# EAGLE design emitter (EAGLE 7.3.0)
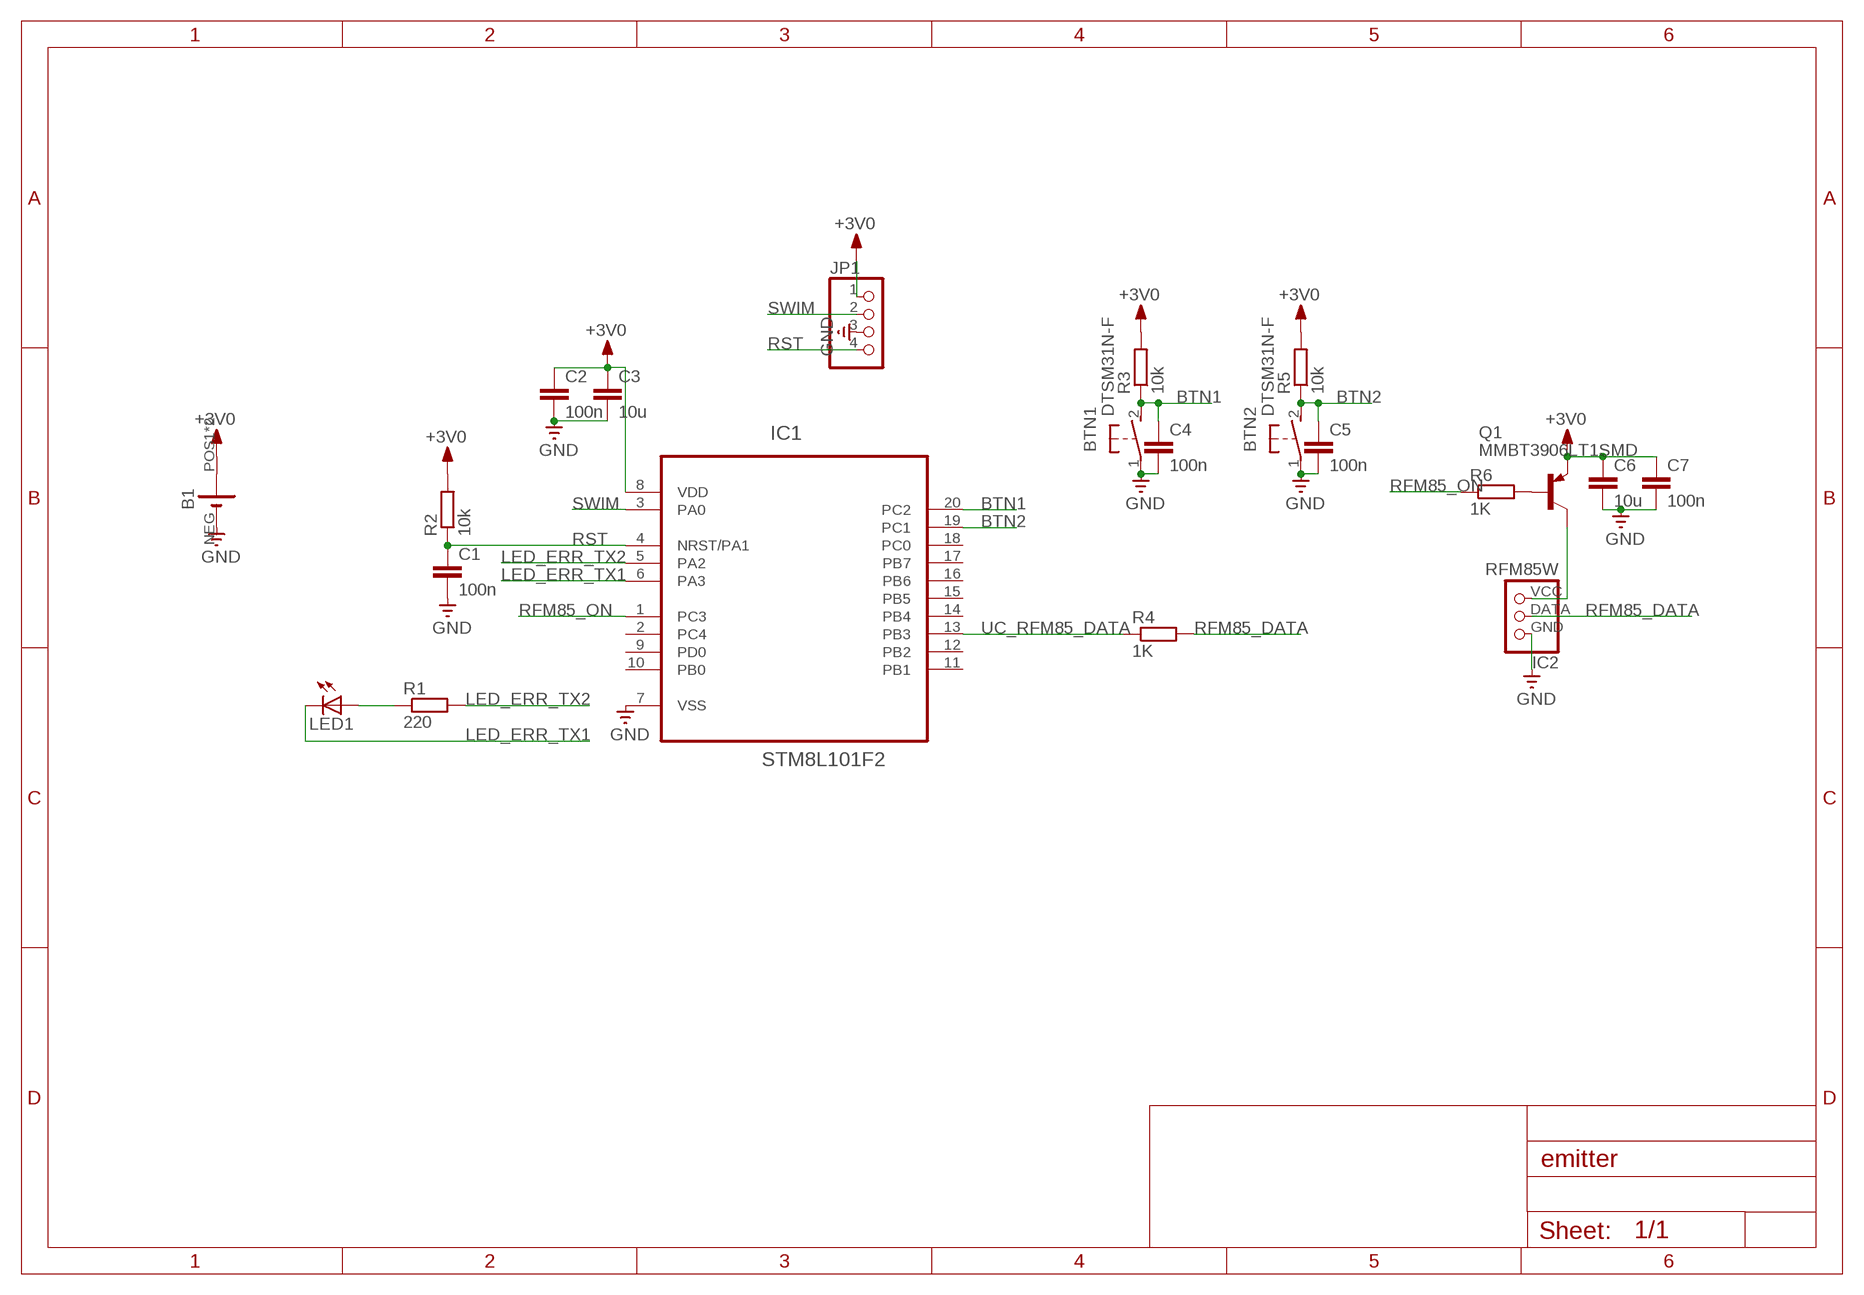
[diagram p0: schematic, sheet 1]

## Parts
B1  CR2032_HOLDER_BC-2003  [CR2032_HOLDER_BC-2003]
BTN1  DTSM31N-F  [DTSM31N-F]
BTN2  DTSM31N-F  [DTSM31N-F]
C1  100n  C-EUC0603K  [C0603K]
C2  100n  C-EUC0603K  [C0603K]
C3  10u  C-EUC0805K  [C0805K]
C4  100n  C-EUC0603K  [C0603K]
C5  100n  C-EUC0603K  [C0603K]
C6  10u  C-EUC0805K  [C0805K]
C7  100n  C-EUC0603K  [C0603K]
IC1  STM8L101F2  [TSSOP20]
IC2  RFM85W  [RFM85W_CON]
JP1  PINHD-1X4  [1X04]
LED1  LED3MM  [LED3MM]
Q1  MMBT3906LT1SMD  [SOT23-BEC]
R1  220  R-EU_R0603  [R0603]
R2  10k  R-EU_R0603  [R0603]
R3  10k  R-EU_R0603  [R0603]
R4  1K  R-EU_R0603  [R0603]
R5  10k  R-EU_R0603  [R0603]
R6  1K  R-EU_R0603  [R0603]

## Nets
+3V0: B1.POS1(+) B1.POS2(+) C2.1 C3.1 C6.1 C7.1 IC1.8(VDD) JP1.1 Q1.E R2.2 R3.2 R5.2
BTN1: BTN1.2 C4.1 IC1.20(PC2) R3.1
BTN2: BTN2.2 C5.1 IC1.19(PC1) R5.1
GND: B1.NEG(-) BTN1.1 BTN2.1 C1.2 C2.2 C3.2 C4.2 C5.2 C6.2 C7.2 IC1.7(VSS) IC2.GND JP1.3
LED_ERR_TX1: IC1.6(PA3) LED1.K(C)
LED_ERR_TX2: IC1.5(PA2) R1.2
N$1: LED1.A R1.1
N$2: IC2.VCC Q1.C
N$8: Q1.B R6.2
RFM85_DATA: IC2.DATA R4.2
RFM85_ON: IC1.1(PC3) R6.1
RST: C1.1 IC1.4(NRST/PA1) JP1.4 R2.1
SWIM: IC1.3(PA0) JP1.2
UC_RFM85_DATA: IC1.13(PB3) R4.1
Unconnected: IC1.2(PC4) IC1.9(PD0) IC1.10(PB0) IC1.11(PB1) IC1.12(PB2) IC1.14(PB4) IC1.15(PB5) IC1.16(PB6) IC1.17(PB7) IC1.18(PC0)

## Library data of the parts
B1 = comp_RFSwitch_v2:CR2032_HOLDER_BC-2003
BTN1 BTN2 = comp_RFSwitch_v3:DTSM31N-F
C1-C7 = resistor:C-EU: CAPACITOR, European symbol
IC1 = comp_RFSwitch_v2:STM8L101F2
IC2 = comp_RFSwitch_v3:RFM85W
JP1 = pinhead:PINHD-1X4: PIN HEADER
LED1 = led:LED: LED OSRAM: - CHIPLED LG R971, LG N971, LY N971, LG Q971, LY Q971, LO R971, LY R971 LH N974, LH R974 LS Q976, LO Q976, LY Q976 LO Q996 - Hyper CHIPLED LW Q18S LB Q993, LB Q99A, LB R99A - SideLED LS A670, LO A670, LY A670, LG A670, LP A670 LB A673, LV A673, LT A673, LW A673 LH A674 LY A675 LS A676, LA A676, LO A676, LY A676, LW A676 LS A679, LY A679, LG A679 - Hyper Micro SIDELED® LS Y876, LA Y876, LO Y876, LY Y876 LT Y87S - SmartLED LW L88C, LW L88S LB L89C, LB L89S, LG L890 LS L89K, LO L89K, LY L89K LS L896, LA L896, LO L896, LY L896 - TOPLED LS T670, LO T670, LY T670, LG T670, LP T670 LSG T670, LSP T670, LSY T670, LOP T670, LYG T670 LG T671, LOG T671, LSG T671 LB T673, LV T673, LT T673, LW T673 LH T674 LS T676, LA T676, LO T676, LY T676, LB T676, LH T676, LSB T676, LW T676 LB T67C, LV T67C, LT T67C, LS T67K, LO T67K, LY T67K, LW E67C LS E67B, LA E67B, LO E67B, LY E67B, LB E67C, LV E67C, LT E67C LW T67C LS T679, LY T679, LG T679 LS T770, LO T770, LY T770, LG T770, LP T770 LB T773, LV T773, LT T773, LW T773 LH T774 LS E675, LA E675, LY E675, LS T675 LS T776, LA T776, LO T776, LY T776, LB T776 LHGB T686 LT T68C, LB T68C - Hyper Mini TOPLED® LB M676 - Mini TOPLED Santana® LG M470 LS M47K, LO M47K, LY M47K Source: http://www.osram.convergy.de LUXEON: - LUMILED® LXK2-PW12-R00, LXK2-PW12-S00, LXK2-PW14-U00, LXK2-PW14-V00 LXK2-PM12-R00, LXK2-PM12-S00, LXK2-PM14-U00 LXK2-PE12-Q00, LXK2-PE12-R00, LXK2-PE12-S00, LXK2-PE14-T00, LXK2-PE14-U00 LXK2-PB12-K00, LXK2-PB12-L00, LXK2-PB12-M00, LXK2-PB14-N00, LXK2-PB14-P00, LXK2-PB14-Q00 LXK2-PR12-L00, LXK2-PR12-M00, LXK2-PR14-Q00, LXK2-PR14-R00 LXK2-PD12-Q00, LXK2-PD12-R00, LXK2-PD12-S00 LXK2-PH12-R00, LXK2-PH12-S00 LXK2-PL12-P00, LXK2-PL12-Q00, LXK2-PL12-R00 Source: www.luxeon.com KINGBRIGHT: KA-3528ASYC Source: www.kingbright.com
Q1 = transistor-pnp:MMBT3906*: PNP Transistror
R1-R6 = resistor:R-EU_: RESISTOR, European symbol

## Board
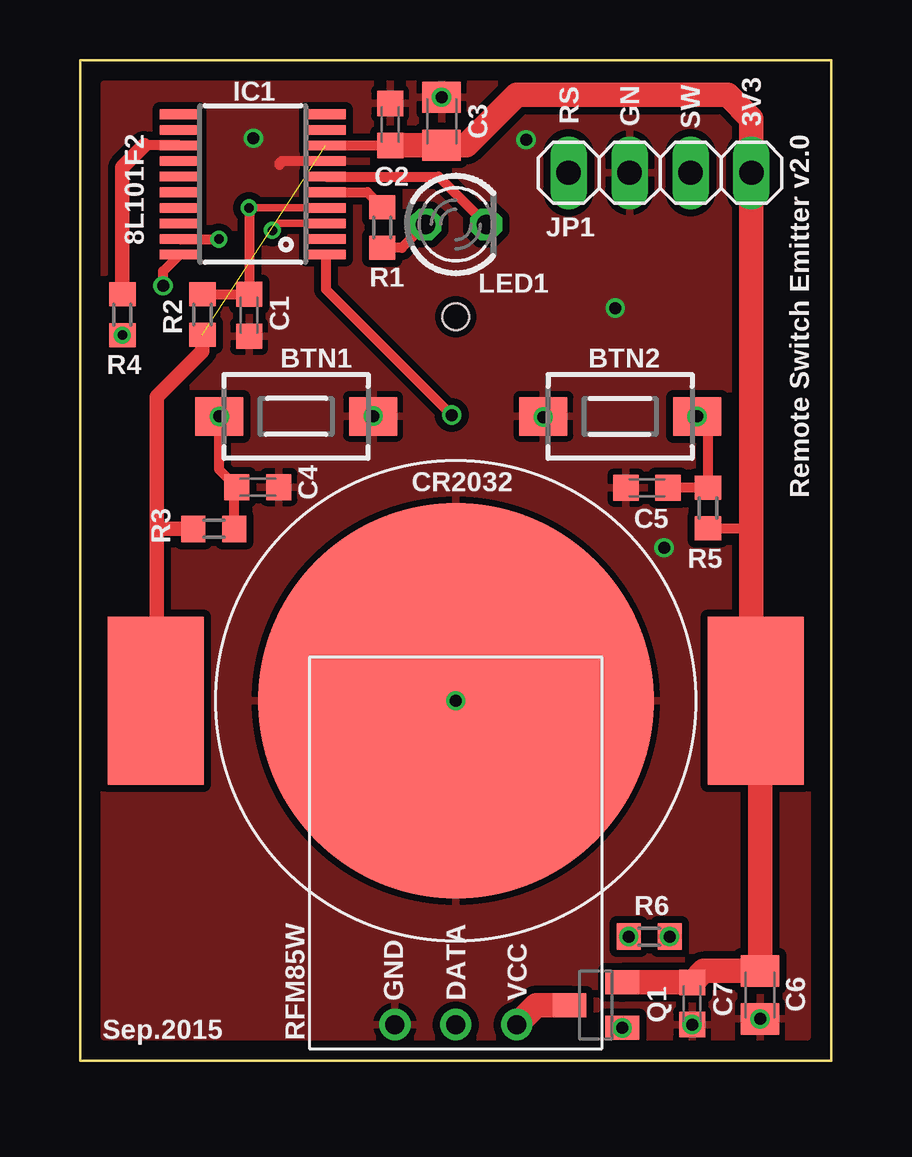
[diagram p1: board, top side]
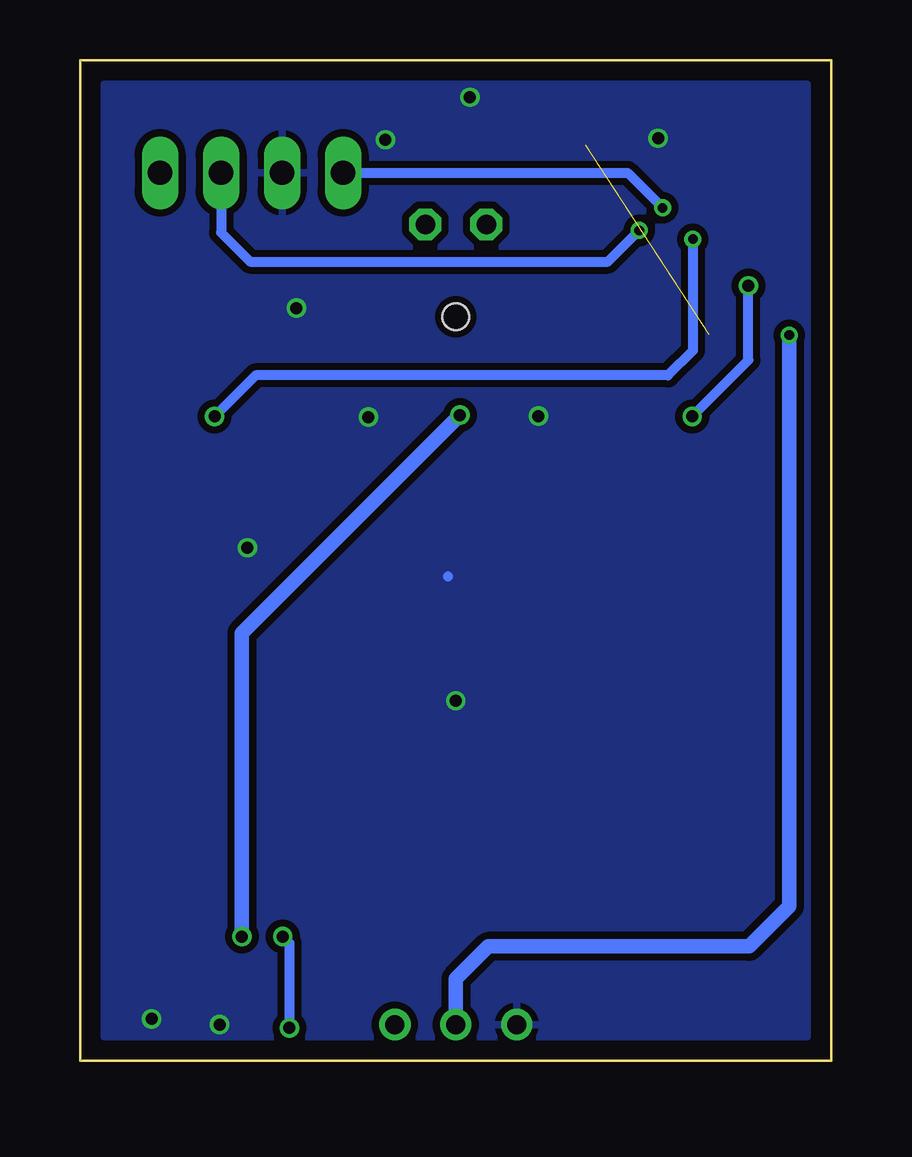
[diagram p2: board, bottom side, seen from below]

Size 31.3 x 41.7 mm. Coordinates in mm from the lower left corner, seen from the top.
Outline: 31.3,41.7 0,41.7 0,0 31.3,0 31.3,41.7
Copper layers (1*16): Top 0.035mm / dielectric 1.5mm / Bottom 0.035mm
Design rules "SeeedStudio_2layer_DRU_no_angle_20140221": minimum track width 6mil, minimum drill 12mil, track to track 6mil, track to pad 6mil, pad to pad 6mil, via to via 6mil, smd to smd 0mil, copper to edge 10mil, drill to drill 10mil, minimum pad ring 10mil, minimum via ring 6mil, stop-mask expansion 2mil, vias tented up to drill 100mil, thermal gap 10mil
Holes 1.1 mm at 15.65,31

### Footprints (pad centres in the part's own frame; a part is rotated, then mirrored left to right if it is on the bottom)
CR2032_HOLDER_BC-2003 = smd 16.5 x 16.5: NEG 0,0 | smd 4 x 7: POS1 -12.5,0; POS2 12.5,0
DTSM31N-F = smd 2 x 1.6: 1 -3.2,0; 2 3.2,0
C0603K = smd 1.05 x 1.08: 1 -0.875,0; 2 0.875,0
C0805K = smd 1.3 x 1.6: 1 -1,0; 2 1,0
TSSOP20 = smd 0.4 x 1.65: 1 -3.575,-3.05; 2 -2.925,-3.05; 3 -2.275,-3.05; 4 -1.625,-3.05; 5 -0.975,-3.05; 6 -0.325,-3.05; 7 0.325,-3.05; 8 0.975,-3.05; 9 1.625,-3.05; 10 2.275,-3.05; 11 2.275,3.05; 12 1.625,3.05; 13 0.975,3.05; 14 0.325,3.05; 15 -0.325,3.05; 16 -0.975,3.05; 17 -1.625,3.05; 18 -2.275,3.05; 19 -2.925,3.05; 20 -3.575,3.05
RFM85W_CON = drill 0.8: DATA 0,1; GND -2.54,1; VCC 2.54,1
1X04 = drill 1.016 long: 1 -3.81,0; 2 -1.27,0; 3 1.27,0; 4 3.81,0
LED3MM = drill 0.813 octagon: A -1.27,0; K 1.27,0
SOT23-BEC = smd 1 x 1.4: B -0.95,-1.1; C 0,1.1; E 0.95,-1.1
R0603 = smd 1 x 1.1: 1 -0.85,0; 2 0.85,0

### Placement (x,y rotation side)
B1  15.65,15 0 top
BTN1  9,26.85 180 top
BTN2  22.5,26.85 0 top
C1  7.04,31.07 270 top
C2  12.91,39.02 90 top
C3  15.06,39.15 90 top
C4  7.39,23.9 0 top
C5  23.61,23.88 180 top
C6  28.32,2.75 270 top
C7  25.5,2.38 270 top
IC1  7.19,37.16 90 top
IC2  15.65,0.51 0 top
JP1  24.16,37 180 top
LED1  15.65,34.85 0 top
Q1  21.48,2.32 90 top
R1  12.59,34.72 90 top
R2  5.09,31.1 270 top
R3  5.57,22.16 180 top
R4  1.75,31.09 270 top
R5  26.16,23.03 270 top
R6  23.71,5.17 180 top

### Tracks (layer width: path | path; a pad name or v marks a point on that pad's centre or on a via)
+3V0  (1 unrouted)
  Top 0.406: IC1.8 C2.1 | R5.2 27.9,22.18 27.97,22.11
  Top 0.61: 27.91,31.55 27.97,31.49 | B1.POS1 3.19,15.04 3.19,22.13 | 3.19,22.13 3.19,27.67 5.09,29.57 R2.2 | R3.2 3.23,22.16 3.19,22.13
  Top 1.016: Q1.E 25.48,3.27 C7.1 25.98,3.75 C6.1 28.32,14.82 B1.POS2 27.97,15.18 27.97,22.11 27.97,31.49 JP1.1 27.97,39.26 26.98,40.25 18.18,40.25 16.09,38.15 C3.1 12.93,38.15 C2.1
BTN1  (via drill 0.5)
  Top 0.406: IC1.20 3.46,32.91 v3.46,32.3 | BTN1.2 5.8,24.62 C4.1 6.42,23.8 R3.1
  Bottom 0.406: v3.46,32.3 3.46,29.2 BTN1.2
  other vias: 5.8,26.85
BTN2  (via drill 0.4, 0.5)
  Top 0.406: C5.1 R5.1 26.16,26.39 BTN2.2 | IC1.19 v5.78,34.23
  Bottom 0.406: v5.78,34.23 5.78,29.59 6.82,28.55 24,28.55 BTN2.2
  other vias: 25.7,26.85
GND  (via drill 0.5)
  Top 0.406: IC1.7 8.45,37.49 arc90 8.29,37.34
  Bottom 0.406: 15.97,20.18 15.98,20.18
  other vias: 25.5,1.51 28.32,1.75 15.65,15.01 12.21,26.86 19.29,26.82 15.06,40.15 7.22,38.44 22.29,31.36 24.33,21.38 18.58,38.38
  pour Top (isolate 0.3): 1,1 1,40.7 30.3,40.7 30.3,1
  pour Bottom (isolate 0.3): 30.3,1 30.3,40.7 1,40.7 1,1
LED_ERR_TX1
  Top 0.406: IC1.6 14.93,36.84 LED1.K
LED_ERR_TX2
  Top 0.406: IC1.5 11.96,36.19 R1.2
N$1
  Top 0.406: LED1.A 13.4,33.87 R1.1
N$2
  Top 1.016: Q1.C 19,2.32 IC2.VCC
N$8  (via drill 0.5)
  Bottom 0.406: R6.2 22.59,4.9 Q1.B
  other vias: 22.59,1.37 22.86,5.17
RFM85_DATA  (via drill 0.4)
  Bottom 0.61: R4.2 1.75,6.44 3.42,4.77 14.29,4.77 15.65,3.42 IC2.DATA
  other vias: 1.75,30.23
RFM85_ON  (via drill 0.5)
  Top 0.406: IC1.1 10.24,32.15 v15.48,26.91
  Bottom 0.61: v15.48,26.91 24.56,17.82 R6.1
  other vias: 24.56,5.17
RST  (via drill 0.4)
  Top 0.305: IC1.4 v7.04,35.54
  Top 0.406: R2.1 7.03,31.95 C1.1 v7.04,35.54
  Bottom 0.406: JP1.4 8.49,37 v7.04,35.54
SWIM  (via drill 0.4)
  Top 0.305: IC1.3 8.29,34.89 v8.01,34.6
  Bottom 0.406: JP1.2 25.43,34.51 24.21,33.3 9.31,33.3 v8.01,34.6
UC_RFM85_DATA
  Top 0.406: IC1.13 2.67,38.14
  Top 0.61: 2.67,38.14 1.75,37.23 R4.1

### Text on the board
tPlace: 8L101F2 | CR2032
tNames: RS | GN | SW | 3V3 | Remote Switch Emitter v2.0 | Sep.2015 | RFM85W